# Altium schematic sheet Power.SchDoc
size A4
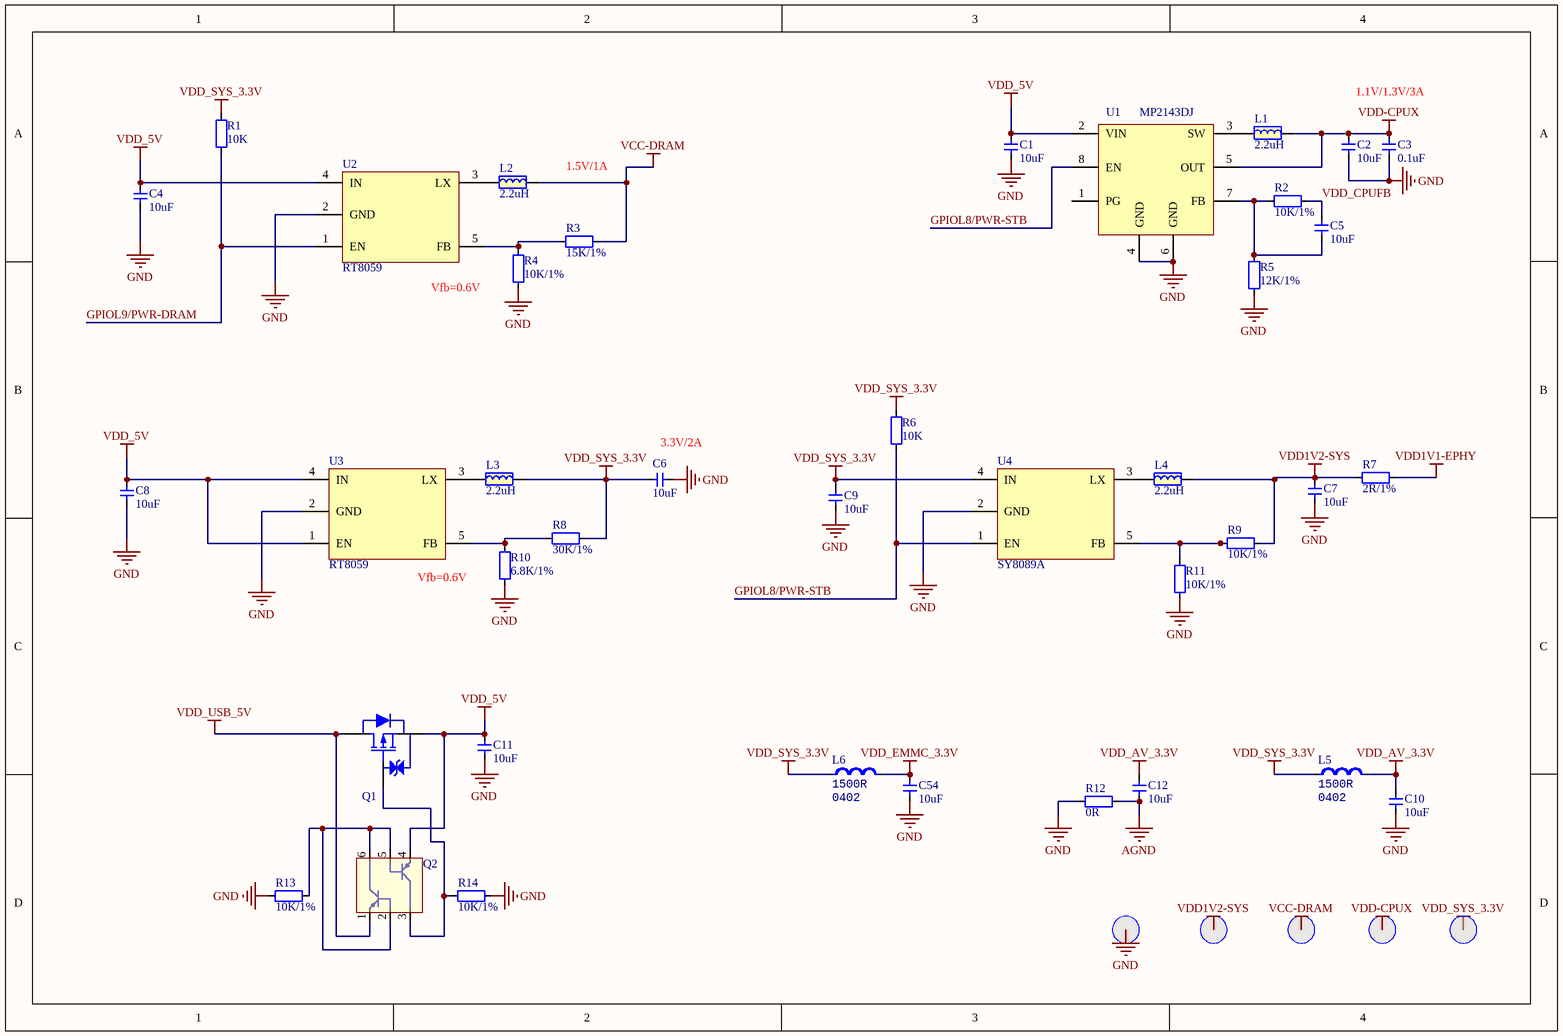
[diagram p0: Power.SchDoc]

## Parts
C1  10uF  [CAP_0402]
C2  10uF  [CAP_0402]
C3  0.1uF  [CAP_0402]
C4  10uF  [CAP_0402]
C5  10uF  [CAP_0402]
C6  10uF  [CAP_0402]
C7  10uF  [CAP_0402]
C8  10uF  [CAP_0402]
C9  10uF  [CAP_0402]
C10  10uF  [CAP_0402]
C11  10uF  [CAP_0402]
C12  10uF  [CAP_0402]
C54  10uF  [CAP_0402]
L1  2.2uH  [2520-L]
L2  2.2uH  [2520-L]
L3  2.2uH  [2520-L]
L4  2.2uH  [2520-L]
L5  value 1500R  Type: 0402  [IND_0402]  (hidden comment: H0402)
L6  value 1500R  Type: 0402  [IND_0402]  (hidden comment: H0402)
Q1  AO3415A  [SOT23-3]  (value not drawn)
Q2  BCM856BS  [SOT363-6]  (value not drawn)
R1  10K  [RES_0402]
R2  10K/1%  [RES_0402]
R3  15K/1%  [RES_0402]
R4  10K/1%  [RES_0402]
R5  12K/1%  [RES_0402]
R6  10K  [RES_0402]
R7  2R/1%  [RES_0402]
R8  30K/1%  [RES_0402]
R9  10K/1%  [RES_0402]
R10  6.8K/1%  [RES_0402]
R11  10K/1%  [RES_0402]
R12  0R  [RES_0402]
R13  10K/1%  [RES_0402]
R14  10K/1%  [RES_0402]
T1  测试点  [TEST_PT]  (value not drawn)
T2  测试点  [TEST_PT]  (value not drawn)
T3  测试点  [TEST_PT]  (value not drawn)
T4  测试点  [TEST_PT]  (value not drawn)
T5  测试点  [TEST_PT]  (value not drawn)
U1  MP2143DJ  [SOT23-8]
U2  RT8059  [SOT23-5]
U3  RT8059  [SOT23-5]
U4  SY8089A  [SOT23-5]

## Nets
AGND: C12.1 R12.1
GND: C1.1 C2.1 C3.1 C4.1 C6.1 C7.1 C8.1 C9.1 C10.1 C11.1 C54.1 R4.1 R5.1 R10.1 R11.1 R12.2 R13.1 R14.2 T1.0 U1.4(GND) U1.6(GND) U2.2(GND) U3.2(GND) U4.2(GND)
VCC-DRAM: L2.2 R3.1 T3.0
VDD1V1-EPHY: R7.2
VDD1V2-SYS: C7.2 L4.2 R7.1 R9.2 T2.0
VDD-CPUX: C2.2 C3.2 L1.2 T4.0 U1.5(OUT)
VDD_5V: C1.2 C4.2 C8.2 C11.2 Q1.2(S) Q2.4 U1.2(VIN) U2.4(IN) U3.1(EN) U3.4(IN)
VDD_AV_3.3V: C10.2 C12.2 L5.2
VDD_EMMC_3.3V: C54.2 L6.2
VDD_SYS_3.3V: C6.2 C9.2 L3.2 L5.1 L6.1 R1.2 R6.2 R8.1 T5.0 U4.4(IN)
VDD_USB_5V: Q1.3(D) Q2.1
GPIOL8/PWR-STB: R6.1 U1.8(EN) U4.1(EN)
GPIOL9/PWR-DRAM: R1.1 U2.1(EN)
VDD_CPUFB: C5.2 R2.2
NetC5_1: C5.1 R2.1 R5.2 U1.7(FB)
NetL1_1: L1.1 U1.3(SW)
NetL2_1: L2.1 U2.3(LX)
NetL3_1: L3.1 U3.3(LX)
NetL4_1: L4.1 U4.3(LX)
NetQ1_1: Q1.1(G) Q2.3 R14.1
NetQ2_2: Q2.2 Q2.5 Q2.6 R13.2
NetR3_2: R3.2 R4.2 U2.5(FB)
NetR8_2: R8.2 R10.2 U3.5(FB)
NetR9_1: R9.1 R11.2 U4.5(FB)

Not connected (* = marked no-connect by the designer): U1 1(PG)

## Notes on the sheet
- 1.1V/1.3V/3A
- (near L2) 1.5V/1A
- Vfb=0.6V
- (near C6) 3.3V/2A

## Library data of the parts
C1-C12 C54 = 电容-0402: Capacitor; Value: 0.1u
L1-L4 = 电感-2520: 磁珠
L5 L6 = Ind_0402: Inductor; Specification: ±5% 100mA; Manufacturer: *
Q1 = AO3415A: MOSFET; Published: 8-Jun-2000; LatestRevisionDate: 17-Jul-2002; LatestRevisionNote: Re-released for DXP Platform.; PackageVersion: 1995/1996; PackageReference: E3; Publisher: Altium Limited; PackageDescription: TO, Flat Index; 3 In-Line, Axial Leads; Body Dia. 4.6mm; Lead Dia. 0.5 mm (max)
Q2 = BCM856BS: Transistor
R1-R14 = 电阻-0402: Resistor; Value: 22R
U1 = MP2143DJ: LDO
U2 U3 = RT8059: LDO
U4 = SY8089A: LDO